# EasyEDA schematic Sheet_1.json
TITLE: Sheet_1; REV: 1.0; Date: 2023-06-08; Sheet: 1/1; Drawn By: venkatakrishnanr; Company: Your Company
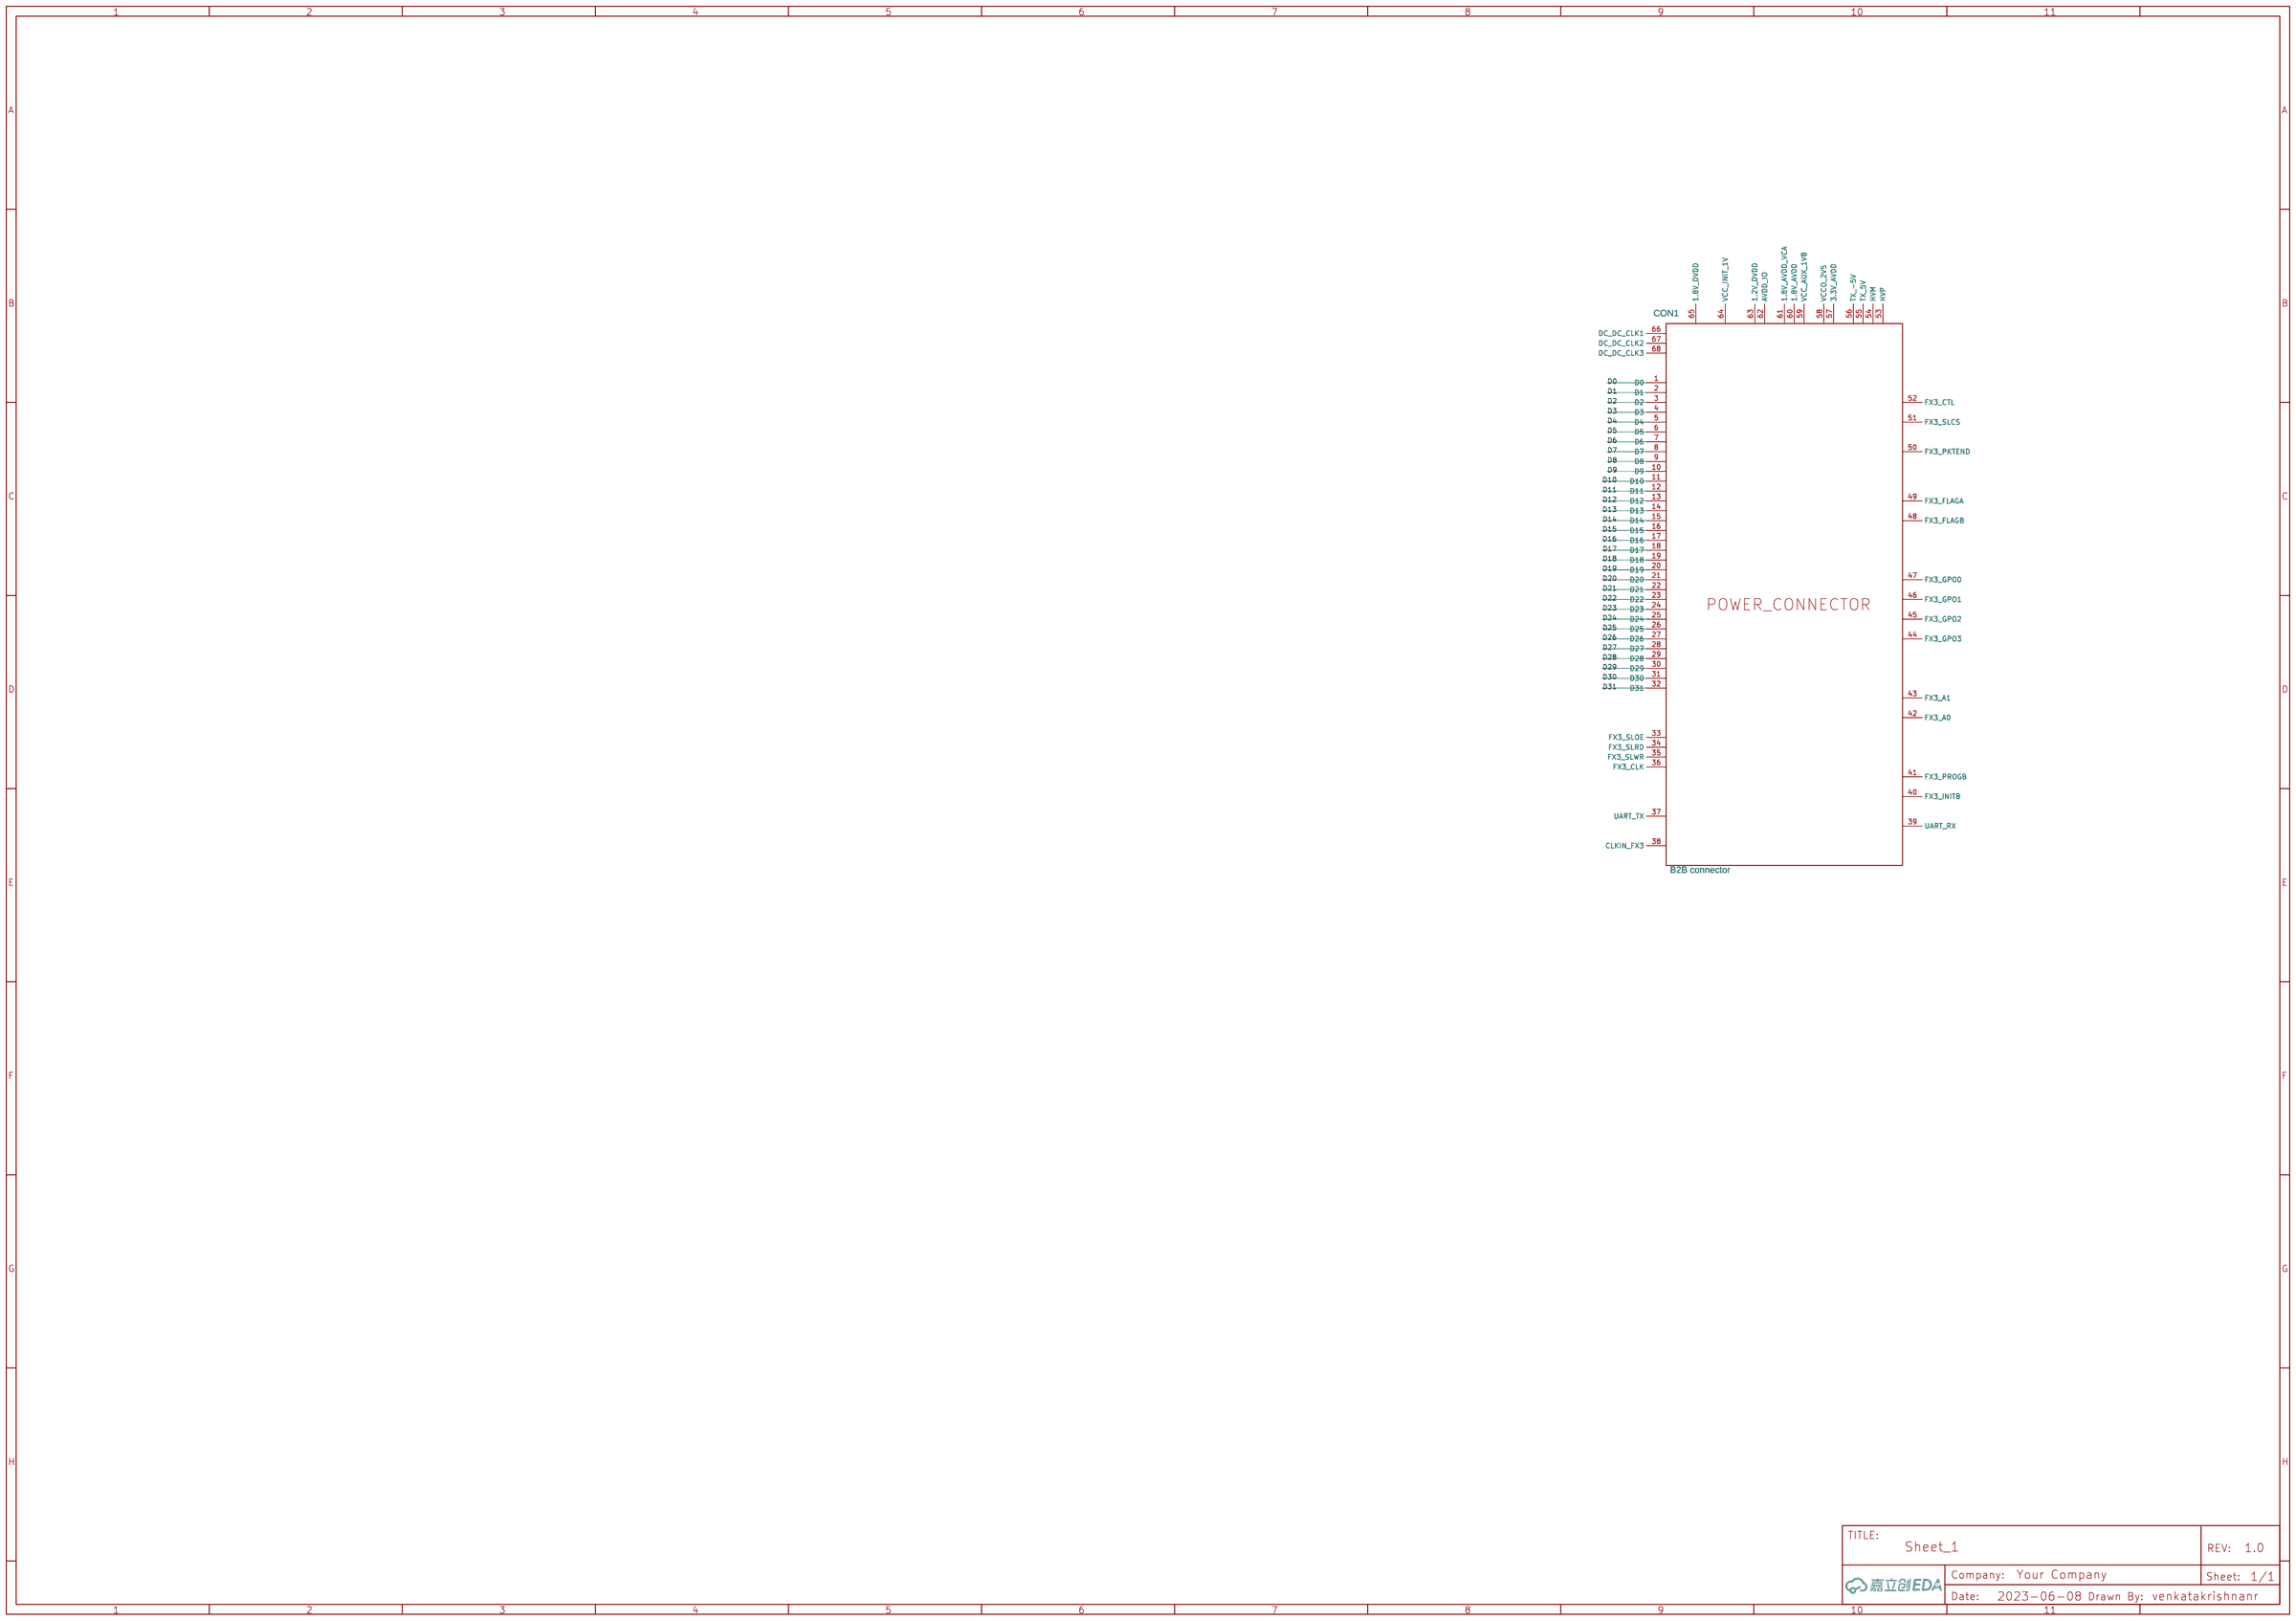
[diagram p0: schematic sheet]

## Parts
CON1  B2B connector

## Library data of the parts
CON1 = B2B connector: Manufacturer Part: 393570003; Supplier Part: 393570003; Contributor: venkatakrishnanr

## Nets

Not connected (* = marked no-connect by the designer): CON1 1(D0) 2(D1) 3(D2) 4(D3) 5(D4) 6(D5) 7(D6) 8(D7) 9(D8) 10(D9) 11(D10) 12(D11) 13(D12) 14(D13) 15(D14) 16(D15) 17(D16) 18(D17) 19(D18) 20(D19) 21(D20) 22(D21) 23(D22) 24(D23) 25(D24) 26(D25) 27(D26) 28(D27) 29(D28) 30(D29) 31(D30) 32(D31) 33(FX3_SLOE) 34(FX3_SLRD) 35(FX3_SLWR) 36(FX3_CLK) 37(UART_TX) 38(CLKIN_FX3) 39(UART_RX) 40(FX3_INITB) 41(FX3_PROGB) 42(FX3_A0) 43(FX3_A1) 44(FX3_GPO3) 45(FX3_GPO2) 46(FX3_GPO1) 47(FX3_GPO0) 48(FX3_FLAGB) 49(FX3_FLAGA) 50(FX3_PKTEND) 51(FX3_SLCS) 52(FX3_CTL) 53(HVP) 54(HVM) 55(TX_5V) 56(TX_-5V) 57(3.3V AVDD) 58(VCCO_2V5) 59(VCC_AUX_1V8) 60(1.8V_AVDD) 61(1.8V_AVDD_VCA) 62(AVDD_IO) 63(1.2V_DVDD) 64(VCC_INIT_1V) 65(1.8V_DVDD) 66(DC_DC_CLK1) 67(DC_DC_CLK2) 68(DC_DC_CLK3)
